# EAGLE schematic buff n' Blend (EAGLE 6.4)
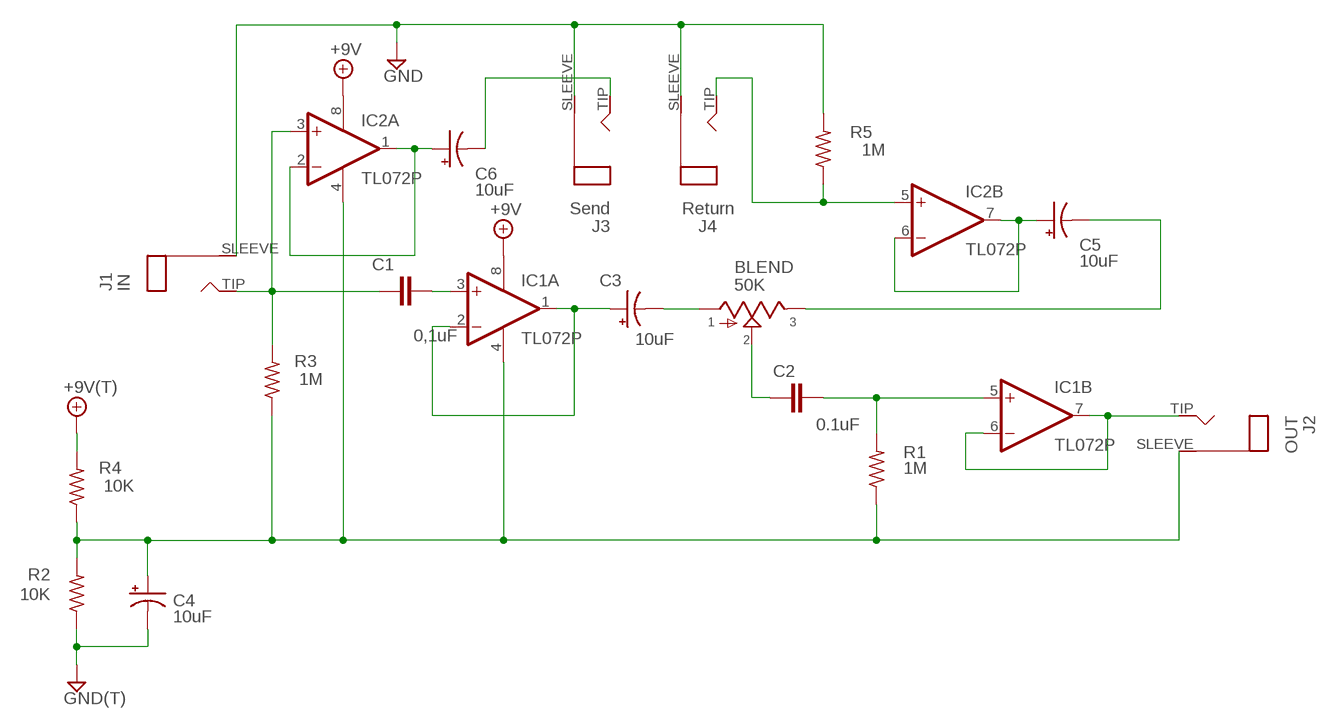
[diagram p0: schematic, sheet 1]

## Parts
+9V1  +9V(T)  [SQUARE]
BLEND  50K  POT16MM  [16MM]
C1  0,1uF  070X0304  [070X030_4]
C2  0.1uF  070X0304  [070X030_4]
C3  10uF  0633  [063_025_3]
C4  10uF  0633  [063_025_3]
C5  10uF  0633  [063_025_3]
C6  10uF  0633  [063_025_3]
GND1  GND(T)  [SQUARE]
IC1  TL072P  [DIL08]
IC2  TL072P  [DIL08]
J1  IN  MONO  [MONO_JACK]
J2  OUT  MONO  [MONO_JACK]
J3  Send  MONO  [MONO_JACK]
J4  Return  MONO  [MONO_JACK]
R1  1M  6MM.5  [R0207/5]
R2  10K  6MM.5  [R0207/5]
R3  1M  6MM.5  [R0207/5]
R4  10K  6MM.5  [R0207/5]
R5  1M  6MM.5  [R0207/5]

## Nets
+9V: +9V1.1(+9V) IC1.8(P:V+) IC2.8(P:V+) R4.2
GND: C4.- GND1.1(GND) J1.SLEEVE J3.SLEEVE J4.SLEEVE R2.1 R5.2
N$1: C1.1 IC2.3(A:+IN) J1.TIP R3.2
N$2: C1.2 IC1.3(A:+IN)
N$3: C3.+ IC1.1(A:OUT) IC1.2(A:-IN)
N$4: BLEND.1 C3.-
N$5: BLEND.2 C2.1
N$6: C2.2 IC1.5(B:+IN) R1.2
N$7: IC1.6(B:-IN) IC1.7(B:OUT) J2.TIP
N$8: C4.+ IC1.4(P:V-) IC2.4(P:V-) J2.SLEEVE R1.1 R2.2 R3.1 R4.1
N$10: IC2.5(B:+IN) J4.TIP R5.1
N$11: BLEND.3 C5.-
N$12: C5.+ IC2.6(B:-IN) IC2.7(B:OUT)
N$13: C6.- J3.TIP
N$14: C6.+ IC2.1(A:OUT) IC2.2(A:-IN)

## Library data of the parts
+9V1 = gm-supply:+9V(T): +9V Voltage Supply use this to hook up +9v throughout a schematic instead of running wire automatically labels the net "+9v" adds a hookup pad to the circuit board
BLEND = gm-pots:POT: Potentiometers the arrow indicates the clockwise motion of th wiper (lug 2) fully counter clockwise there is no resistance between lugs 1 and 2 fully clockwise the resistance between lugs 1 and 2 is the value of the pot
C1 C2 = gm-caps-film-chicklet:070X030: 0.0001 - .01uF (100 - 10,000pF) Panasonic ECQ-B 7mm x 3mm 50 or 63V: 0.0001 - .01uF (100 - 10,000pF);
C3-C6 = gm-caps-electro-pol:063: 33 - 220uF Xicon values at Mouser.com 10V: 220uF; 16V: 100uF; 25V: 100uF; 50V: 33uF
GND1 = gm-supply:GND(T): Ground use this to hook up ground (GND) throughout a schematic instead of running wire automatically labels the net "GND" adds a hookup pad to the circuit board (you can use several)
IC1 IC2 = gm-ics:TL072: OP AMP
J1-J4 = gm-jacks:MONO: Mono 1/4" Phone Jack
R1-R5 = gm-resistors:6MM: 6mm Resistors Leads spaced 1-6 holes apart for 0.1" perfboard. Suitable for 1/4 watt resistors.